# EAGLE schematic nocLock_Rev1 (EAGLE 7.1.0)
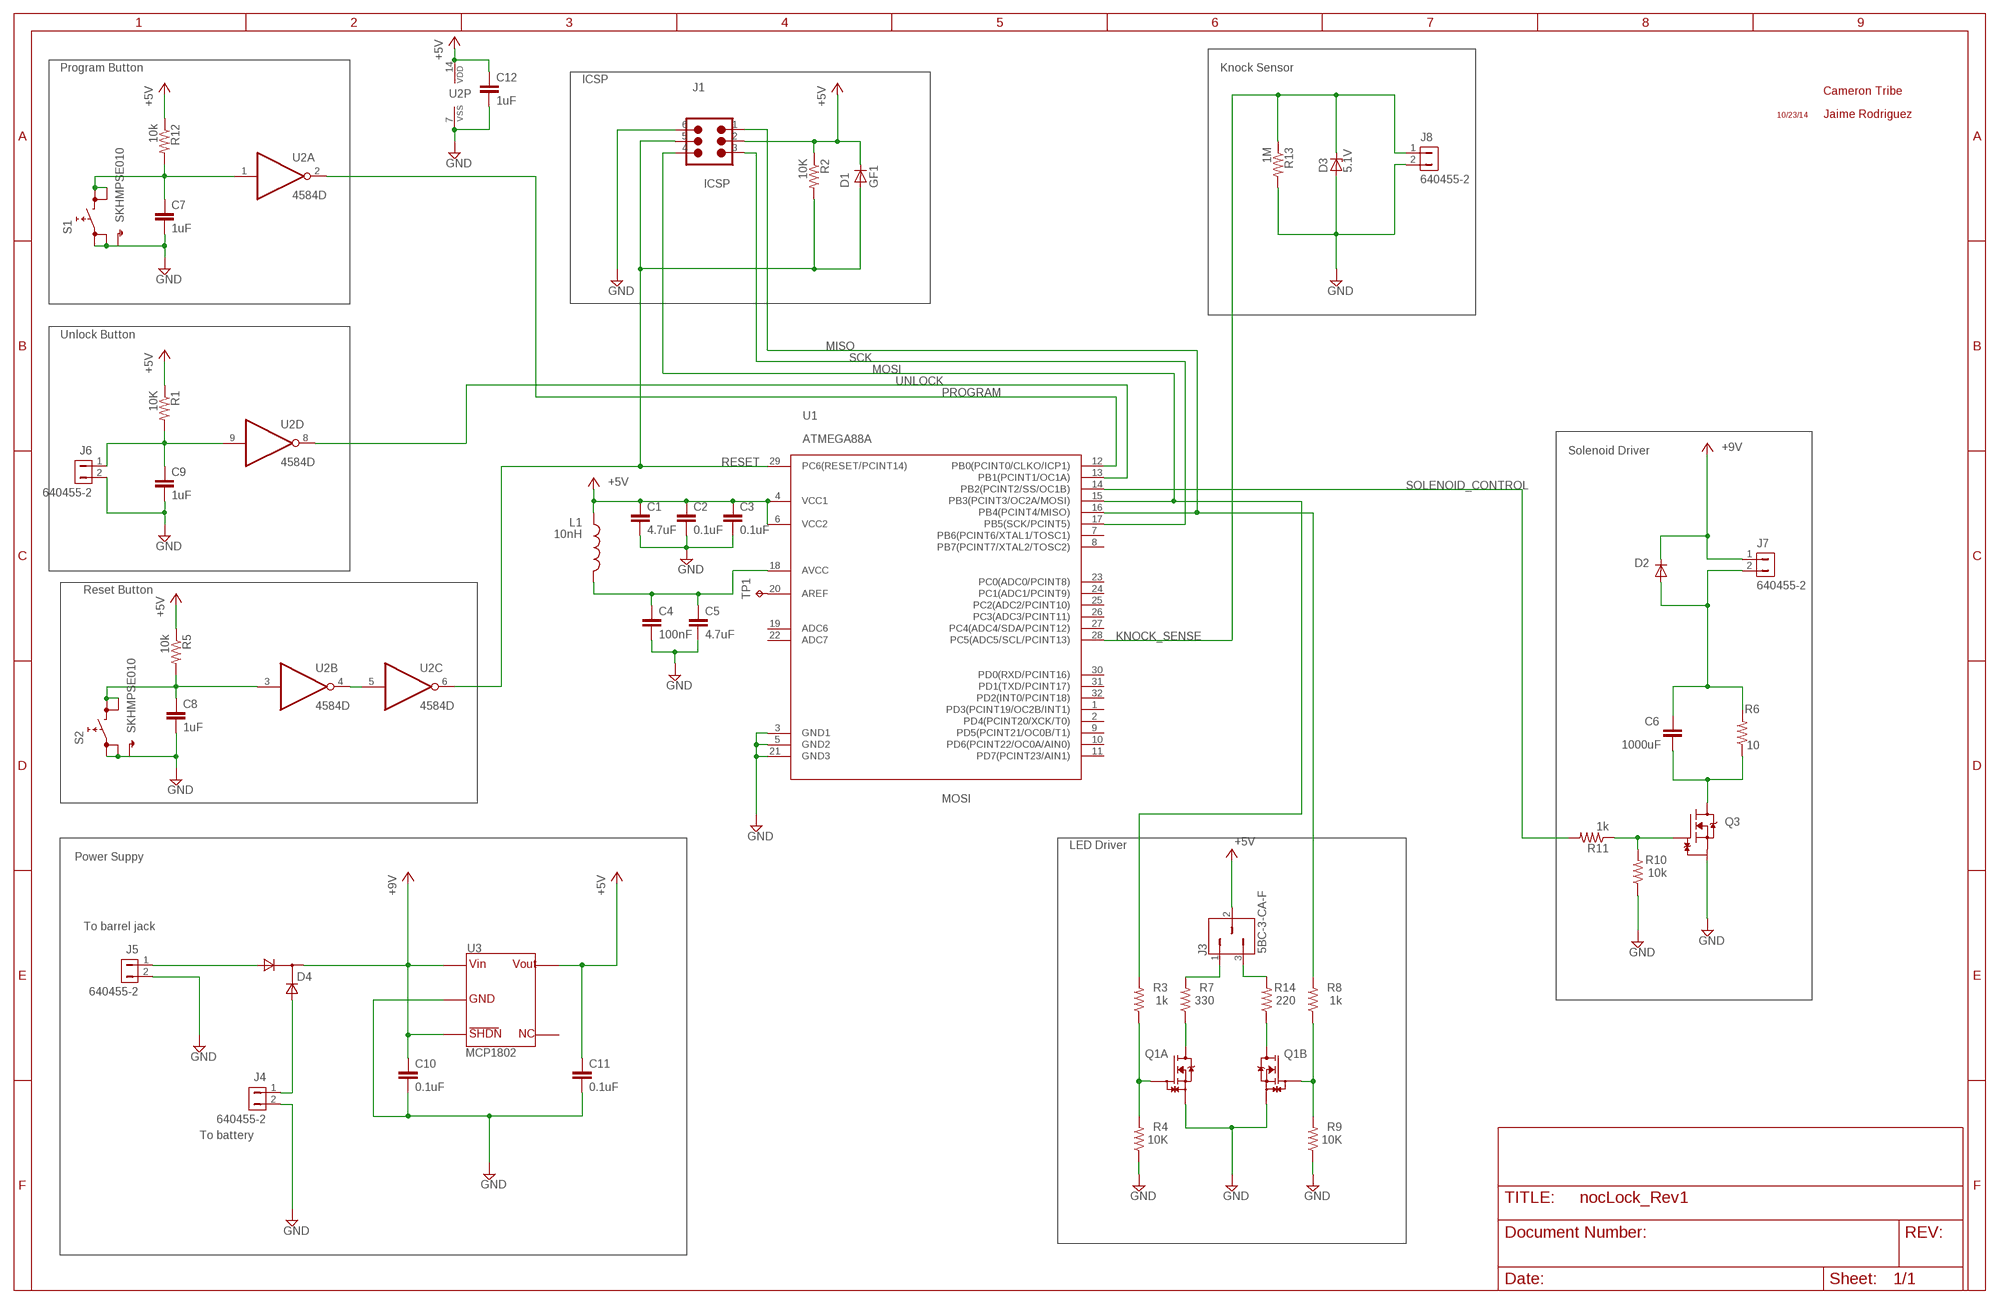
[diagram p0: schematic, sheet 1]

## Parts
C1  4.7uF  C-EUC0805  [C0805]
C2  0.1uF  C-EUC0805  [C0805]
C3  0.1uF  C-EUC0805  [C0805]
C4  100nF  C-EUC0805  [C0805]
C5  4.7uF  C-EUC0805  [C0805]
C6  1000uF  C-EUC0805  [C0805]
C7  1uF  C-EUC0805  [C0805]
C8  1uF  C-EUC0805  [C0805]
C9  1uF  C-EUC0805  [C0805]
C10  0.1uF  C-EUC0805  [C0805]
C11  0.1uF  C-EUC0805  [C0805]
C12  1uF  C-EUC0805  [C0805]
D1  GF1  [SMA-DO214AC]
D2  GF1  [SMA-DO214AC]
D3  5.1V  ZENER-DIODESOT23  [SOT23]
D4  PMEG2005CT,215  [SOT-23]
J1  ICSP  [ICSP]
J3  5BC-3-CA-F  [3_PIN_CONNECTOR]
J4  640455-2  [2-PIN_CONNECTOR]
J5  640455-2  [2-PIN_CONNECTOR]
J6  640455-2  [2-PIN_CONNECTOR]
J7  640455-2  [2-PIN_CONNECTOR]
J8  640455-2  [2-PIN_CONNECTOR]
L1  10nH  L-USL4532C  [L4532M]
Q1  DMN63D8LDW-7  [SOT363]
Q3  DMG1012UW-7  [SOT323]
R1  10K  R-US_R0805  [R0805]
R2  10K  R-US_R0805  [R0805]
R3  1k  R-US_R0805  [R0805]
R4  10K  R-US_R0805  [R0805]
R5  10k  R-US_R0805  [R0805]
R6  10  R-US_R2512  [R2512]
R7  330  R-US_R0805  [R0805]
R8  1k  R-US_R0805  [R0805]
R9  10K  R-US_R0805  [R0805]
R10  10k  R-US_R0805  [R0805]
R11  1k  R-US_R0805  [R0805]
R12  10k  R-US_R0805  [R0805]
R13  1M  R-US_R0805  [R0805]
R14  220  R-US_R0805  [R0805]
S1  SKHMPSE010  [SKHMPXE010]
S2  SKHMPSE010  [SKHMPXE010]
TP1  TPTP19R  [TP19R]
U1  ATMEGA88A  [TQFP32]
U2  4584D  [SO14]
U3  MCP1802  [SOT23-5]

## Nets
+5V: C1.1 C2.1 C3.1 C11.1 C12.1 D1.K(C) J1.2 J3.2 L1.1 R1.1 R2.1 R5.1 R12.1 U1.4(VCC1) U1.6(VCC2) U2.14(P:VDD) U3.5(VOUT)
+9V: C10.1 D2.K(C) D4.2(C) J7.1 U3.1(VIN) U3.3(SHDN)
GND: C1.2 C2.2 C3.2 C4.2 C5.2 C7.2 C8.2 C9.2 C10.2 C11.2 C12.2 D3.1(A) J1.6 J4.2 J5.2 J6.2 J8.2 Q1.S1(A:S) Q1.S2(B:S) Q3.3(S) R4.1 R9.1 R10.1 R13.2 S1.1(1.1) S1.2(1.2) S2.1(1.1) S2.2(1.2) U1.3(GND1) U1.5(GND2) U1.21(GND3) U2.7(P:VSS) U3.2(GND)
KNOCK_SENSE: D3.3(C) J8.1 R13.1 U1.28(PC5(ADC5/SCL/PCINT13))
MISO: J1.1 R8.2 U1.16(PB4(PCINT4/MISO))
MOSI: J1.4 R3.2 U1.15(PB3(PCINT3/OC2A/MOSI))
N$1: Q1.D1(A:D) R7.1
N$2: Q1.G2(B:G) R8.1 R9.2
N$3: C9.1 J6.1 R1.2 U2.9(D:I)
N$4: D4.3(A1) J5.1
N$5: J3.1 R7.2
N$6: J3.3 R14.2
N$7: C4.1 C5.1 L1.2 U1.18(AVCC)
N$8: Q1.D2(B:D) R14.1
N$9: Q3.2(G) R10.2 R11.1
N$10: C6.1 D2.A J7.2 R6.2
N$11: C6.2 Q3.1(D) R6.1
N$12: U2.4(B:O) U2.5(C:I)
N$13: TP1.TP U1.20(AREF)
N$16: C8.1 R5.2 S2.3(2.1) S2.4(2.2) U2.3(B:I)
N$19: C7.1 R12.2 S1.3(2.1) S1.4(2.2) U2.1(A:I)
N$21: Q1.G1(A:G) R3.1 R4.2
PROGRAM: U1.12(PB0(PCINT0/CLKO/ICP1)) U2.2(A:O)
RESET: D1.A J1.5 R2.2 U1.29(PC6(RESET/PCINT14)) U2.6(C:O)
RESET1: D4.1(A2) J4.1
SCK: J1.3 U1.17(PB5(SCK/PCINT5))
SOLENOID_CONTROL: R11.2 U1.14(PB2(PCINT2/SS/OC1B))
UNLOCK: U1.13(PB1(PCINT1/OC1A)) U2.8(D:O)
Unconnected: S1.5(SH) S2.5(SH) U1.1(PD3(PCINT19/OC2B/INT1)) U1.2(PD4(PCINT20/XCK/T0)) U1.7(PB6(PCINT6/XTAL1/TOSC1)) U1.8(PB7(PCINT7/XTAL2/TOSC2)) U1.9(PD5(PCINT21/OC0B/T1)) U1.10(PD6(PCINT22/OC0A/AIN0)) U1.11(PD7(PCINT23/AIN1)) U1.19(ADC6) U1.22(ADC7) U1.23(PC0(ADC0/PCINT8)) U1.24(PC1(ADC1/PCINT9)) U1.25(PC2(ADC2/PCINT10)) U1.26(PC3(ADC3/PCINT11)) U1.27(PC4(ADC4/SDA/PCINT12)) U1.30(PD0(RXD/PCINT16)) U1.31(PD1(TXD/PCINT17)) U1.32(PD2(INT0/PCINT18)) U2.10(E:O) U2.11(E:I) U2.12(F:O) U2.13(F:I) U3.4(NC)

## Notes on the sheet
- Program Button | Knock Sensor
- ICSP
- Cameron Tribe
- 10/23/14 | Jaime Rodriguez
- Unlock Button
- Solenoid Driver
- Reset Button
- LED Driver
- Power Suppy
- To barrel jack
- To battery

## Library data of the parts
C1-C12 = rcl:C-EU: CAPACITOR, European symbol
D1 D2 = diode:GF1: DIODE
D3 = diode:ZENER-DIODE: Z-Diode
D4 = nocLock_temp:PMEG2005CT,215
J1 = nocLock_temp_Rev2:ICSP: Programming ICSP Header
J3 = nocLock_temp_Rev2:5BC-3-CA-F: Connector Recept, 3-Pin
J4-J8 = nocLock_temp_Rev2:640455-2: 2 Pin Rectangular Connector
L1 = rcl:L-US: INDUCTOR, American symbol
Q1 = nocLock_temp_Rev2:DMN63D8LDW-7: Dual MOSFET 2N-CH 30V 220MA SOT363
Q3 = nocLock_temp:DMG1012UW-7: MOSFET N-CH 20V 1A SOT323 (For Solenoid)
R1-R14 = rcl:R-US_: RESISTOR, American symbol
S1 S2 = switch:SKHMP*E010: 6.2 X 6.5mm TACT Switch (SMD) Source: http://www3.alps.co.jp/WebObjects/catalog.woa/PDF/E/Switch/Tact/SKHM/SKHM.PDF
TP1 = testpad:TP: Test pad
U1 = nocLock_temp:ATMEGA88A: ATMega88A 8-Bit Microcontroller 23 GPIO pins RISC Architecture Up to 20 MHz
U2 = 45xx:4584: Hex SCHMITT TRIGGER (74C14)
U3 = nocLock_temp:MCP1802: 5V Voltage Regulator MCP1802 Input Voltage Range: 2.0- 10.0 V Output Voltage 5V Current Max: 300 mA 25 uA Quiescent Current